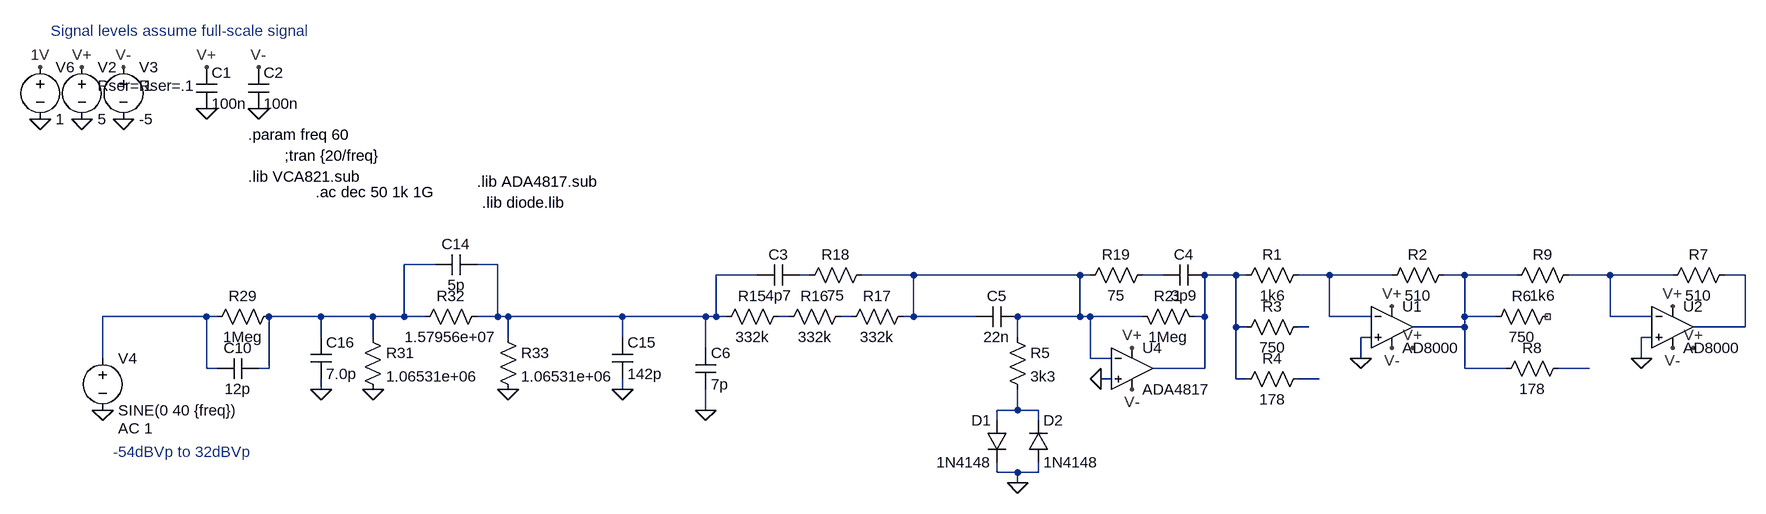
[diagram p0: schematic attensOnly.asc]
attensOnly.asc, the LTspice schematic file:
Version 4
SHEET 1 2624 836
WIRE 240 -160 192 -160
WIRE 336 -160 304 -160
WIRE 736 -144 672 -144
WIRE 816 -144 800 -144
WIRE 976 -144 896 -144
WIRE 1232 -144 976 -144
WIRE 1248 -144 1232 -144
WIRE 1360 -144 1328 -144
WIRE 1472 -144 1424 -144
WIRE 1488 -144 1472 -144
WIRE 1616 -144 1568 -144
WIRE 1712 -144 1616 -144
WIRE 1824 -144 1792 -144
WIRE 1904 -144 1824 -144
WIRE 2048 -144 1984 -144
WIRE 2144 -144 2048 -144
WIRE 2256 -144 2224 -144
WIRE -112 -80 -272 -80
WIRE -96 -80 -112 -80
WIRE 64 -80 -16 -80
WIRE 144 -80 64 -80
WIRE 192 -80 192 -160
WIRE 192 -80 144 -80
WIRE 224 -80 192 -80
WIRE 336 -80 336 -160
WIRE 336 -80 304 -80
WIRE 352 -80 336 -80
WIRE 528 -80 352 -80
WIRE 656 -80 528 -80
WIRE 672 -80 672 -144
WIRE 672 -80 656 -80
WIRE 688 -80 672 -80
WIRE 784 -80 768 -80
WIRE 880 -80 864 -80
WIRE 976 -80 976 -144
WIRE 976 -80 960 -80
WIRE 1072 -80 976 -80
WIRE 1232 -80 1232 -144
WIRE 1232 -80 1136 -80
WIRE 1248 -80 1232 -80
WIRE 1328 -80 1248 -80
WIRE 1424 -80 1424 -144
WIRE 1424 -80 1408 -80
WIRE 1616 -80 1616 -144
WIRE 1680 -80 1616 -80
WIRE 1824 -80 1824 -144
WIRE 1872 -80 1824 -80
WIRE 2048 -80 2048 -144
WIRE 2112 -80 2048 -80
WIRE 1472 -64 1472 -144
WIRE 1488 -64 1472 -64
WIRE 1584 -64 1568 -64
WIRE 1824 -64 1824 -80
WIRE 1824 -64 1744 -64
WIRE 2256 -64 2256 -144
WIRE 2256 -64 2176 -64
WIRE 64 -48 64 -80
WIRE 144 -48 144 -80
WIRE 352 -48 352 -80
WIRE 528 -48 528 -80
WIRE 1136 -48 1136 -80
WIRE 1680 -48 1664 -48
WIRE 2112 -48 2096 -48
WIRE 656 -32 656 -80
WIRE -272 -16 -272 -80
WIRE 1248 -16 1248 -80
WIRE 1280 -16 1248 -16
WIRE 1664 -16 1664 -48
WIRE 2096 -16 2096 -48
WIRE -112 0 -112 -80
WIRE -96 0 -112 0
WIRE -16 0 -16 -80
WIRE -16 0 -32 0
WIRE 1424 0 1424 -80
WIRE 1424 0 1344 0
WIRE 1824 0 1824 -64
WIRE 1888 0 1824 0
WIRE 2016 0 1968 0
WIRE 1280 16 1264 16
WIRE 1472 16 1472 -64
WIRE 1488 16 1472 16
WIRE 1600 16 1568 16
WIRE 64 32 64 16
WIRE 528 32 528 16
WIRE 656 64 656 32
WIRE 1136 64 1136 32
WIRE 1136 64 1104 64
WIRE 1168 64 1136 64
WIRE 1104 80 1104 64
WIRE 1168 80 1168 64
WIRE 1104 160 1104 144
WIRE 1136 160 1104 160
WIRE 1168 160 1168 144
WIRE 1168 160 1136 160
WIRE 1136 176 1136 160
FLAG -304 -384 0
FLAG -240 -384 0
FLAG -304 -464 V+
FLAG -240 -464 V-
FLAG -272 64 0
FLAG -32 -400 0
FLAG -112 -400 0
FLAG -112 -464 V+
FLAG -32 -464 V-
FLAG -368 -384 0
FLAG -368 -464 1V
FLAG 1312 -32 V+
FLAG 1312 32 V-
FLAG 1264 16 0
FLAG 352 32 0
FLAG 144 32 0
FLAG 528 32 0
FLAG 64 32 0
FLAG 1712 -96 V+
FLAG 1712 -32 V-
FLAG 1744 -32 V+
FLAG 1664 -16 0
FLAG 1136 176 0
FLAG 2144 -96 V+
FLAG 2144 -32 V-
FLAG 2176 -32 V+
FLAG 2096 -16 0
FLAG 656 64 0
SYMBOL voltage -304 -480 R0
WINDOW 123 0 0 Left 2
WINDOW 39 24 44 Left 2
SYMATTR SpiceLine Rser=.1
SYMATTR InstName V2
SYMATTR Value 5
SYMBOL voltage -240 -480 R0
WINDOW 123 0 0 Left 2
WINDOW 39 24 44 Left 2
SYMATTR SpiceLine Rser=.1
SYMATTR InstName V3
SYMATTR Value -5
SYMBOL voltage -272 -32 R0
WINDOW 123 24 124 Left 2
WINDOW 39 0 0 Left 2
SYMATTR Value2 AC 1
SYMATTR InstName V4
SYMATTR Value SINE(0 40 {freq})
SYMBOL cap -128 -464 R0
SYMATTR InstName C1
SYMATTR Value 100n
SYMATTR SpiceLine Rser=.01
SYMBOL cap -48 -464 R0
SYMATTR InstName C2
SYMATTR Value 100n
SYMATTR SpiceLine Rser=.01
SYMBOL voltage -368 -480 R0
WINDOW 123 0 0 Left 2
WINDOW 39 0 0 Left 2
SYMATTR InstName V6
SYMATTR Value 1
SYMBOL Opamps\\opamp2 1312 -64 R0
SYMATTR InstName U4
SYMATTR Value ADA4817
SYMBOL res 1424 -64 M270
WINDOW 0 32 56 VTop 2
WINDOW 3 0 56 VBottom 2
SYMATTR InstName R21
SYMATTR Value 1Meg
SYMBOL res 784 -96 R90
WINDOW 0 0 56 VBottom 2
WINDOW 3 32 56 VTop 2
SYMATTR InstName R15
SYMATTR Value 332k
SYMBOL res 880 -96 R90
WINDOW 0 0 56 VBottom 2
WINDOW 3 32 56 VTop 2
SYMATTR InstName R16
SYMATTR Value 332k
SYMBOL res 976 -96 R90
WINDOW 0 0 56 VBottom 2
WINDOW 3 32 56 VTop 2
SYMATTR InstName R17
SYMATTR Value 332k
SYMBOL cap 800 -160 R90
WINDOW 0 0 32 VBottom 2
WINDOW 3 32 32 VTop 2
SYMATTR InstName C3
SYMATTR Value 4p7
SYMBOL res 912 -160 R90
WINDOW 0 0 56 VBottom 2
WINDOW 3 32 56 VTop 2
SYMATTR InstName R18
SYMATTR Value 75
SYMBOL res 1344 -160 R90
WINDOW 0 0 56 VBottom 2
WINDOW 3 32 56 VTop 2
SYMATTR InstName R19
SYMATTR Value 75
SYMBOL cap 1424 -160 R90
WINDOW 0 0 32 VBottom 2
WINDOW 3 32 32 VTop 2
SYMATTR InstName C4
SYMATTR Value 3p9
SYMBOL res 0 -96 R90
WINDOW 0 0 56 VBottom 2
WINDOW 3 32 56 VTop 2
SYMATTR InstName R29
SYMATTR Value 1Meg
SYMBOL cap -32 -16 R90
WINDOW 0 0 32 VBottom 2
WINDOW 3 32 32 VTop 2
SYMATTR InstName C10
SYMATTR Value 12p
SYMBOL res 128 -64 R0
SYMATTR InstName R31
SYMATTR Value 1.06531e+06
SYMBOL res 320 -96 R90
WINDOW 0 0 56 VBottom 2
WINDOW 3 32 56 VTop 2
SYMATTR InstName R32
SYMATTR Value 1.57956e+07
SYMBOL res 336 -64 R0
SYMATTR InstName R33
SYMATTR Value 1.06531e+06
SYMBOL cap 304 -176 R90
WINDOW 0 0 32 VBottom 2
WINDOW 3 32 32 VTop 2
SYMATTR InstName C14
SYMATTR Value 5p
SYMBOL cap 512 -48 R0
SYMATTR InstName C15
SYMATTR Value 142p
SYMBOL cap 48 -48 R0
SYMATTR InstName C16
SYMATTR Value 7.0p
SYMBOL Opamps\\AD\\AD8000 1712 -128 R0
SYMATTR InstName U1
SYMBOL res 1584 -160 R90
WINDOW 0 0 56 VBottom 2
WINDOW 3 32 56 VTop 2
SYMATTR InstName R1
SYMATTR Value 1k6
SYMBOL res 1808 -160 R90
WINDOW 0 0 56 VBottom 2
WINDOW 3 32 56 VTop 2
SYMATTR InstName R2
SYMATTR Value 510
SYMBOL res 1584 -80 R90
WINDOW 0 0 56 VBottom 2
WINDOW 3 32 56 VTop 2
SYMATTR InstName R3
SYMATTR Value 750
SYMBOL res 1584 0 R90
WINDOW 0 0 56 VBottom 2
WINDOW 3 32 56 VTop 2
SYMATTR InstName R4
SYMATTR Value 178
SYMBOL cap 1136 -96 R90
WINDOW 0 0 32 VBottom 2
WINDOW 3 32 32 VTop 2
SYMATTR InstName C5
SYMATTR Value 22n
SYMBOL res 1120 -64 R0
SYMATTR InstName R5
SYMATTR Value 3k3
SYMBOL diode 1120 80 M0
SYMATTR InstName D1
SYMATTR Value 1N4148
SYMBOL diode 1152 144 M180
WINDOW 0 24 64 Left 2
WINDOW 3 24 0 Left 2
SYMATTR InstName D2
SYMATTR Value 1N4148
SYMBOL Opamps\\AD\\AD8000 2144 -128 R0
SYMATTR InstName U2
SYMBOL res 2240 -160 R90
WINDOW 0 0 56 VBottom 2
WINDOW 3 32 56 VTop 2
SYMATTR InstName R7
SYMATTR Value 510
SYMBOL res 2000 -160 R90
WINDOW 0 0 56 VBottom 2
WINDOW 3 32 56 VTop 2
SYMATTR InstName R9
SYMATTR Value 1k6
SYMBOL cap 640 -32 R0
SYMATTR InstName C6
SYMATTR Value 7p
SYMBOL res 1968 -96 R90
WINDOW 0 0 56 VBottom 2
WINDOW 3 32 56 VTop 2
SYMATTR InstName R6
SYMATTR Value 750
SYMBOL res 1984 -16 R90
WINDOW 0 0 56 VBottom 2
WINDOW 3 32 56 VTop 2
SYMATTR InstName R8
SYMATTR Value 178
TEXT 8 -328 Left 2 !;tran {20/freq}
TEXT -48 -360 Left 2 !.param freq 60
TEXT -48 -296 Left 2 !.lib VCA821.sub
TEXT 56 -272 Left 2 !.ac dec 50 1k 1G
TEXT -352 -520 Left 2 ;Signal levels assume full-scale signal
TEXT -256 128 Left 2 ;-54dBVp to 32dBVp
TEXT 304 -288 Left 2 !.lib ADA4817.sub
TEXT 312 -256 Left 2 !.lib diode.lib

The netlist it stands for:
* attensOnly.asc
V2 V+ 0 5 Rser=.1
V3 V- 0 -5 Rser=.1
V4 N011 0 SINE(0 40 {freq}) AC 1
C1 V+ 0 100n Rser=.01
C2 V- 0 100n Rser=.01
V6 1V 0 1
XU4 0 N004 V+ V- N006 ADA4817  ; pins In+ In- V+ V- OUT
R21 N006 N004 1Meg
R15 N012 N002 332k
R16 N013 N012 332k
R17 N004 N013 332k
C3 N003 N002 4p7
R18 N004 N003 75
R19 N005 N004 75
C4 N006 N005 3p9
R29 N001 N011 1Meg
C10 N001 N011 12p
R31 N001 0 1.06531e+06
R32 N002 N001 1.57956e+07
R33 N002 0 1.06531e+06
C14 N002 N001 5p
C15 N002 0 142p
C16 N001 0 7.0p
XU1 0 N007 V+ V- N008 AD8000  ; pins In+ In- V+ V- OUT
R1 N007 N006 1k6
R2 N008 N007 510
R3 N014 N006 750
R4 N016 N006 178
C5 N004 N004 22n
R5 N004 N017 3k3
D1 N017 0 1N4148
D2 0 N017 1N4148
XU2 0 N009 V+ V- N010 AD8000  ; pins In+ In- V+ V- OUT
R7 N010 N009 510
R9 N009 N008 1k6
C6 N002 0 7p
R6 NC_01 N008 750
R8 N015 N008 178
.model D D
.lib standard.dio
;tran {20/freq}
.param freq 60
.lib VCA821.sub
.ac dec 50 1k 1G
* Signal levels assume full-scale signal
* -54dBVp to 32dBVp
.lib ADA4817.sub
.lib diode.lib
.backanno
.end